# Altium project LLA1305.PrjPcb (part 1 of 2)
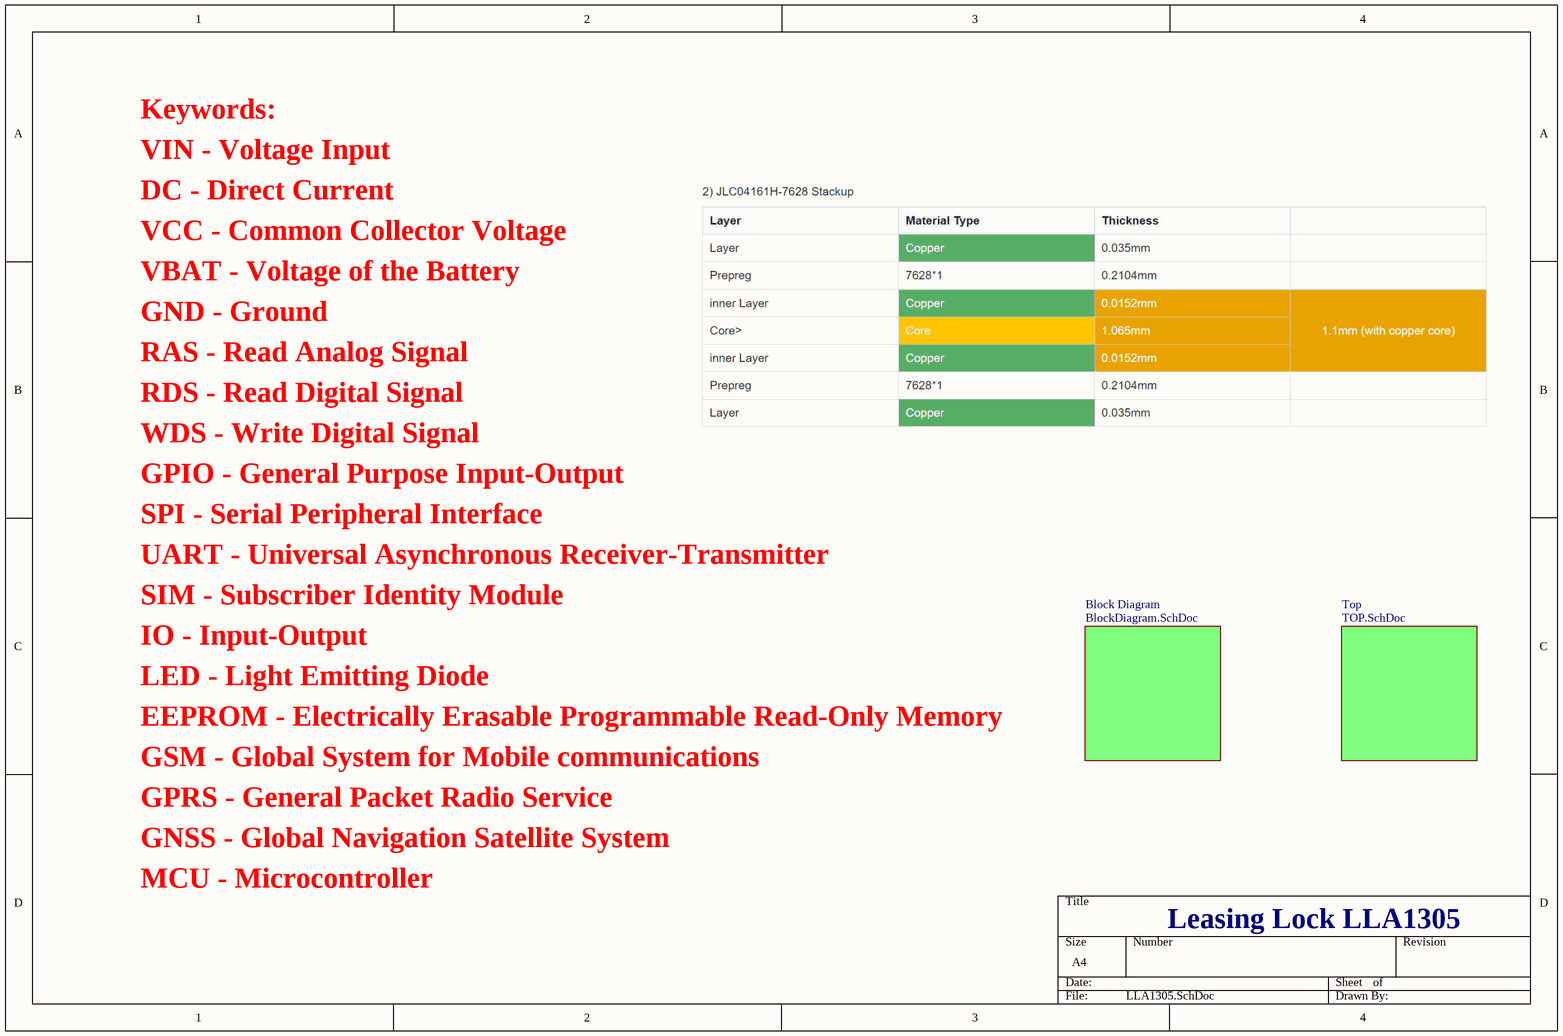
[diagram p0: LLA1305.SchDoc]
11 sheets, 164 parts. Net scope: flat (ports and power ports of the same name join across sheets).
Board file: LLA1305.PcbDoc
Sheets:
  LLA1305.SchDoc
    Block Diagram = BlockDiagram.SchDoc
    Top = TOP.SchDoc
      GSM/GPRS/GNSS Module = MC60.SchDoc
      Microcontroller = MCU.SchDoc
      EEPROM Memory = EEPROM.SchDoc
      SIM Card Slot = SIM.SchDoc
      Power Management = Power.SchDoc
      RS-485 Transceiver = RS485.SchDoc
      IO PORTs = IOs.SchDoc
      Interface LEDs = LEDs.SchDoc

## Sheet LLA1305.SchDoc
size A4; SheetNumber: 1; SheetTotal: 11

### Sub-sheets
Block Diagram = BlockDiagram.SchDoc: no entries
Top = TOP.SchDoc: no entries

### Notes on the sheet
- Keywords:
- VIN - Voltage Input
- DC - Direct Current
- VCC - Common Collector Voltage
- VBAT - Voltage of the Battery
- RAS - Read Analog Signal
- GND - Ground
- RDS - Read Digital Signal
- WDS - Write Digital Signal
- GPIO - General Purpose Input-Output
- SPI - Serial Peripheral Interface
- UART - Universal Asynchronous Receiver-Transmitter
- SIM - Subscriber Identity Module
- IO - Input-Output
- LED - Light Emitting Diode
- EEPROM - Electrically Erasable Programmable Read-Only Memory
- GSM - Global System for Mobile communications
- GPRS - General Packet Radio Service
- GNSS - Global Navigation Satellite System
- MCU - Microcontroller
- Leasing Lock LLA1305

## Sheet BlockDiagram.SchDoc
size A3; SheetNumber: 2; SheetTotal: 11
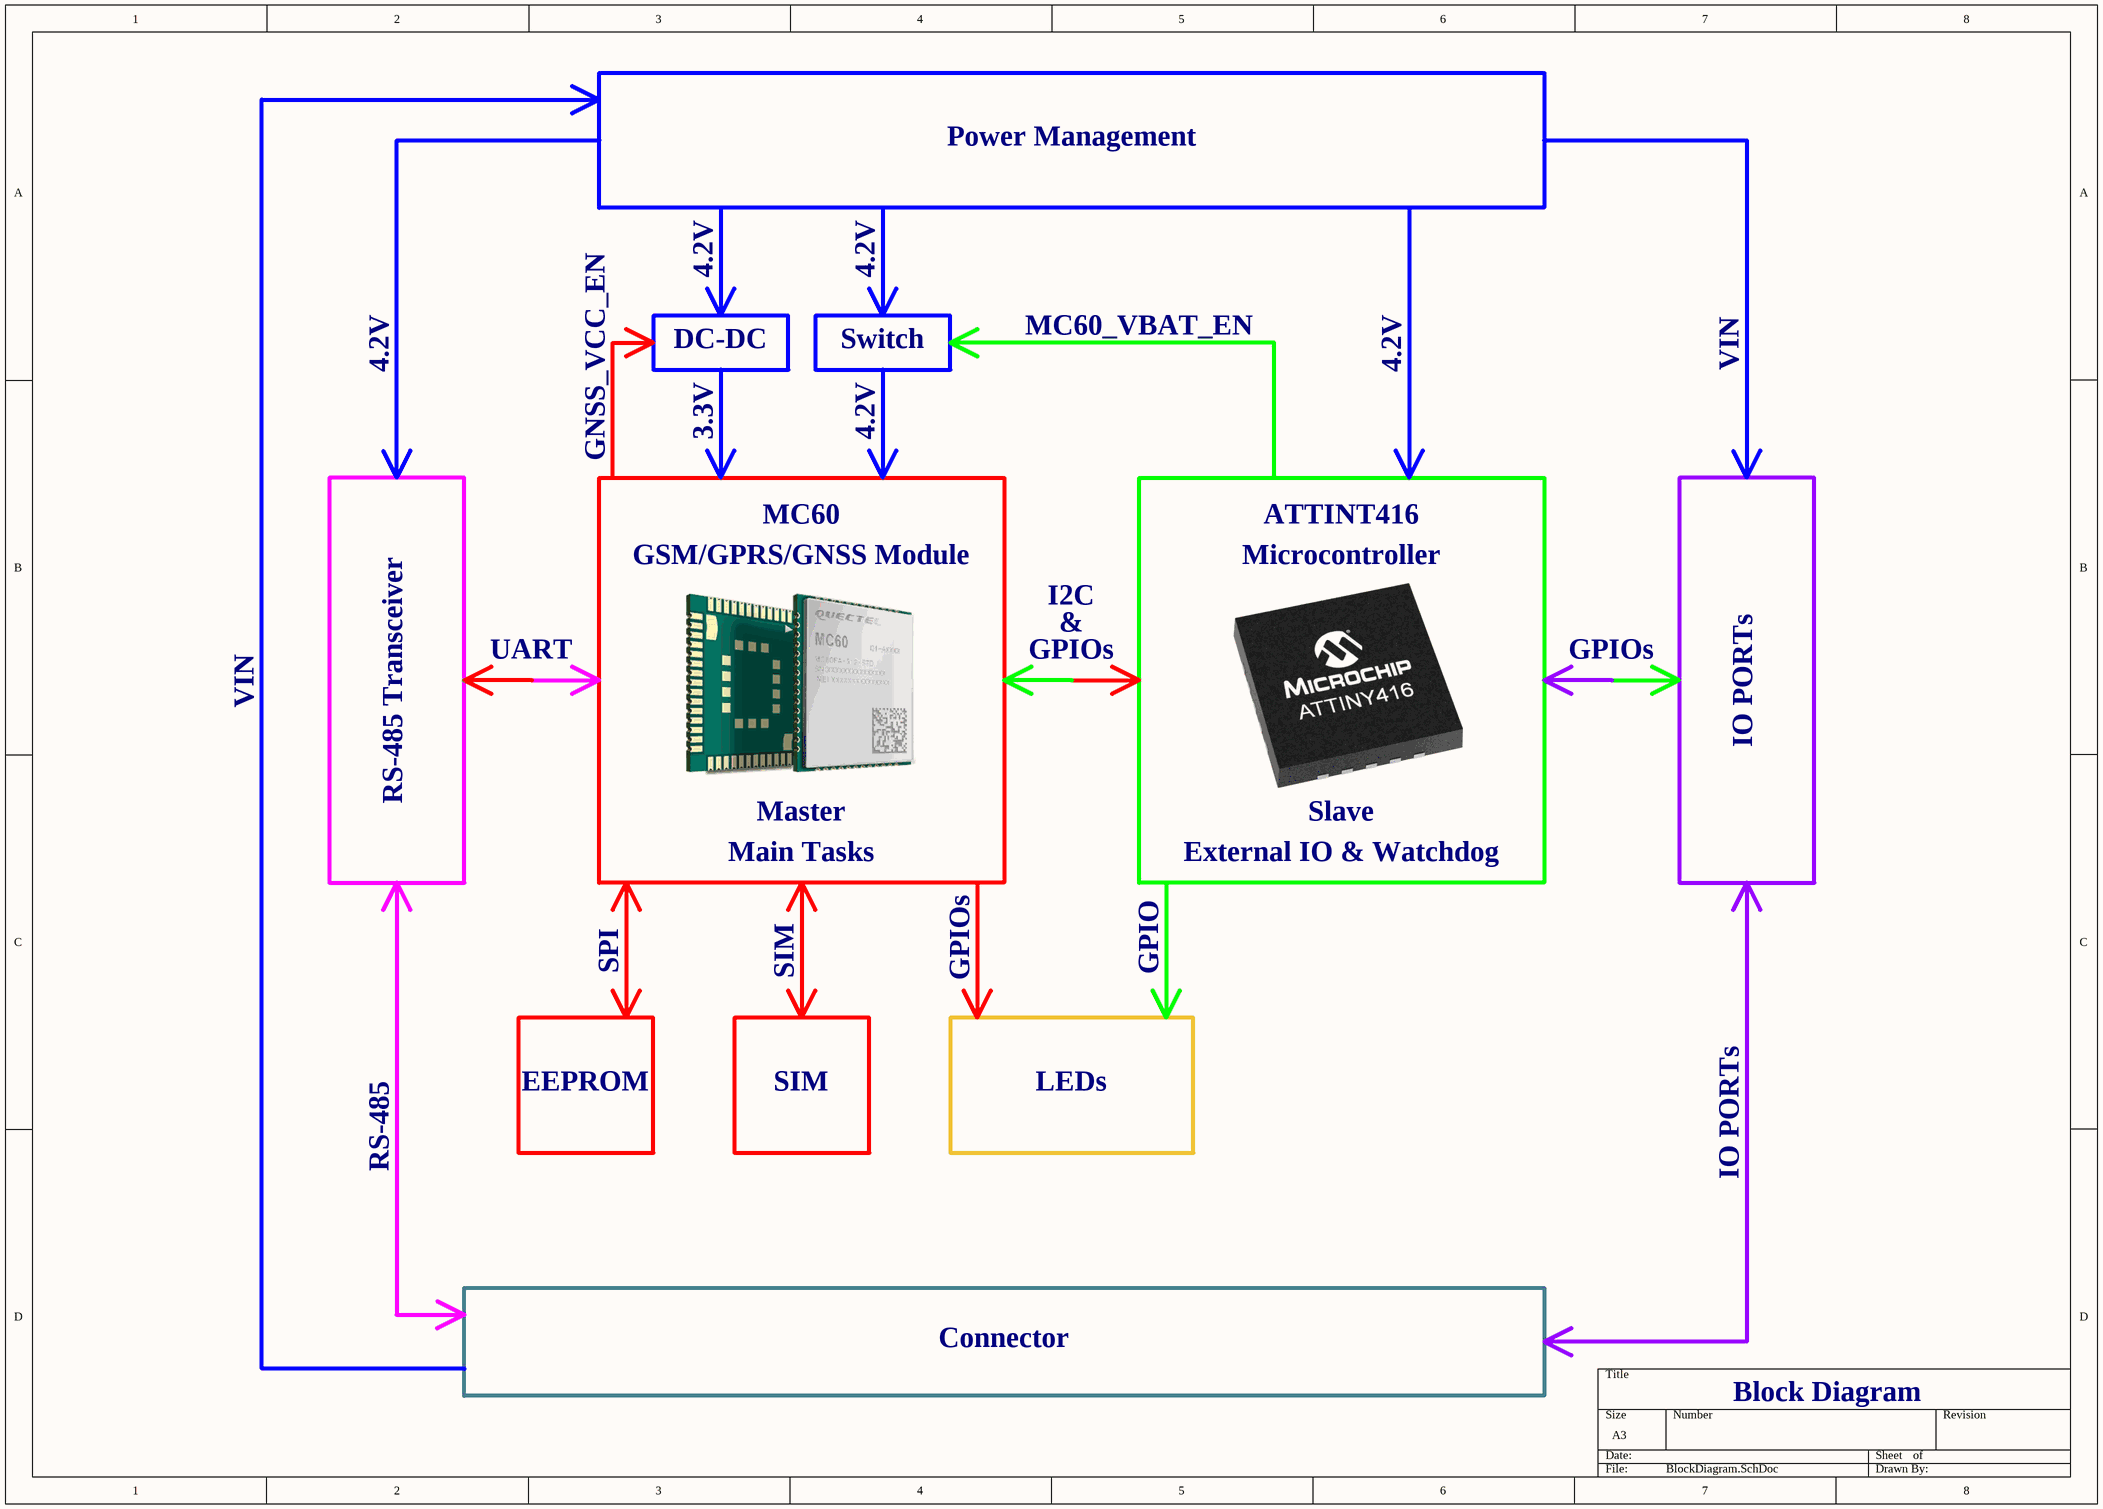
[diagram p1: BlockDiagram.SchDoc]

### Notes on the sheet
- Power Management
- 4.2V
- GNSS_VCC_EN
- DC-DC
- Switch
- MC60_VBAT_EN
- VIN
- 3.3V
- MC60
- GSM/GPRS/GNSS Module
- ATTINT416
- Microcontroller
- &
- I2C
- RS-485 Transceiver
- UART
- GPIOs
- IO PORTs
- Master
- Slave
- Main Tasks
- External IO & Watchdog
- SPI
- SIM
- GPIO
- RS-485
- EEPROM
- LEDs
- Connector
- Block Diagram

## Sheet TOP.SchDoc
size A3; SheetNumber: 3; SheetTotal: 11
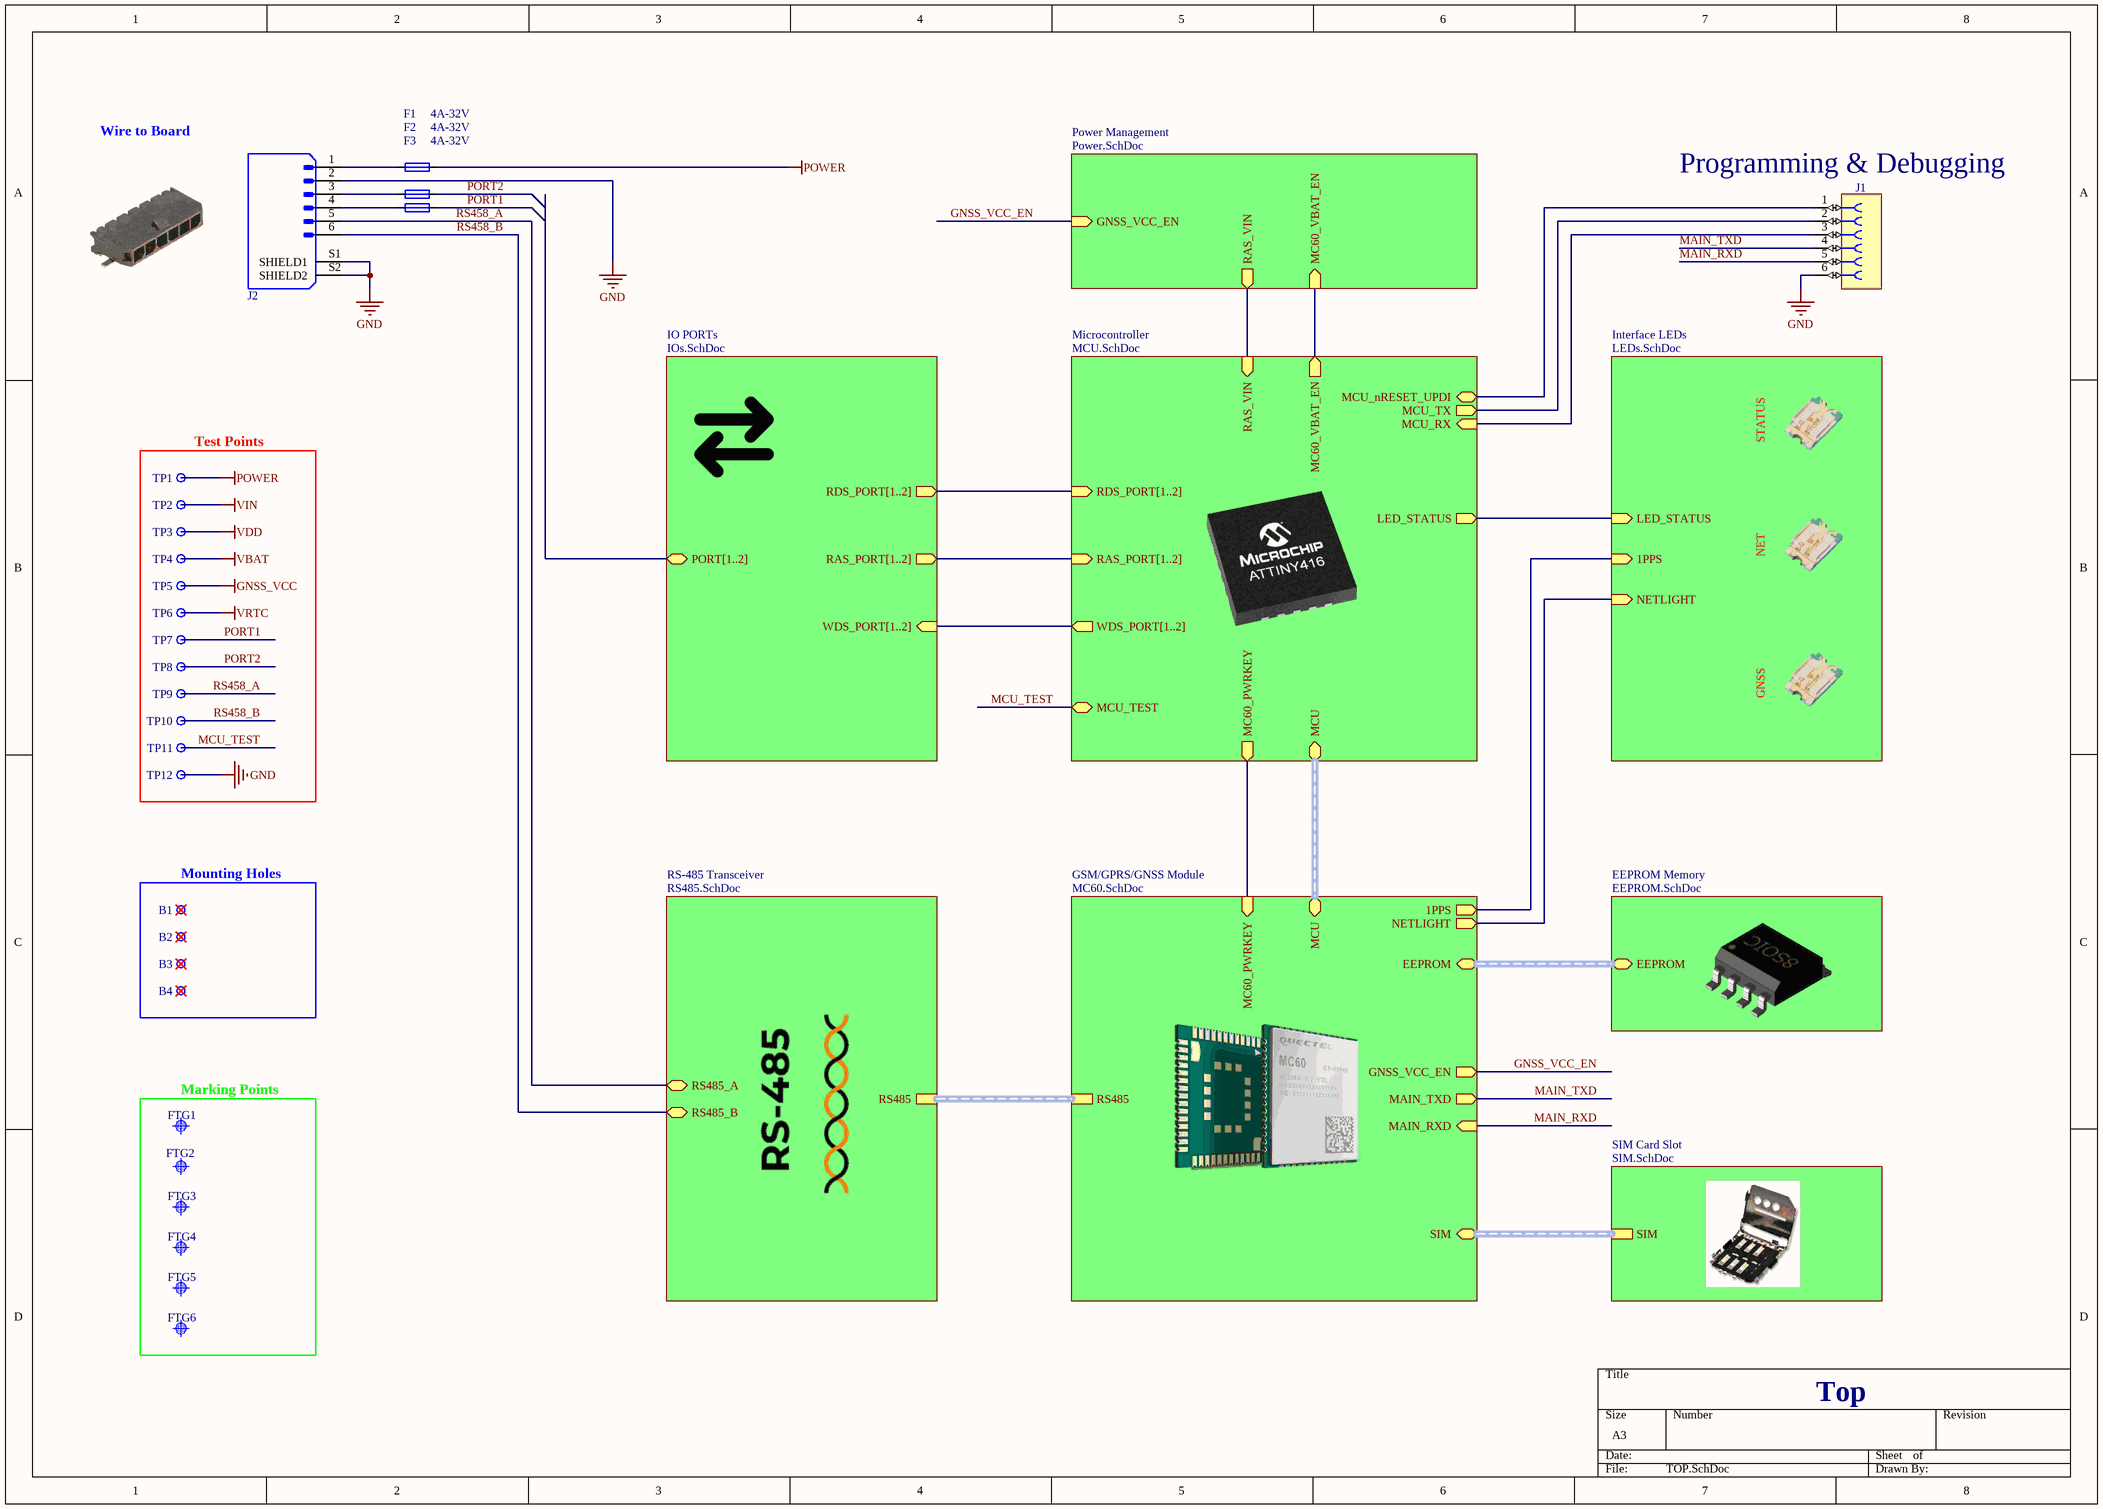
[diagram p2: TOP.SchDoc]

### Parts
B1  Non Plated Hole  [MTG520]  (value not drawn)  (no BOM)
B2  Non Plated Hole  [MTG520]  (value not drawn)  (no BOM)
B3  Non Plated Hole  [MTG520]  (value not drawn)  (no BOM)
B4  Non Plated Hole  [MTG520]  (value not drawn)  (no BOM)
F1  4A-32V  [FUSC_LITTELFUSE_466]
F2  4A-32V  [FUSC_LITTELFUSE_466]
F3  4A-32V  [FUSC_LITTELFUSE_466]
FTG1  Use only in PCB  [FIDUCIAL_TOP_C100-200]  (value not drawn)
FTG2  Use only in PCB  [FIDUCIAL_TOP_C100-200]  (value not drawn)
FTG3  Use only in PCB  [FIDUCIAL_TOP_C100-200]  (value not drawn)
FTG4  Use only in PCB  [FIDUCIAL_TOP_C100-200]  (value not drawn)
FTG5  Use only in PCB  [FIDUCIAL_TOP_C100-200]  (value not drawn)
FTG6  Use only in PCB  [FIDUCIAL_TOP_C100-200]  (value not drawn)
J1  Socket 6  [SAMTEC_SSW-106-01-L-S]  (value not drawn)
J2  43650-0613  [MOLEX_43650-0613]  (value not drawn)
TP1  Test Point  [TPS127]  (value not drawn)
TP2  Test Point  [TPS127]  (value not drawn)
TP3  Test Point  [TPS127]  (value not drawn)
TP4  Test Point  [TPS127]  (value not drawn)
TP5  Test Point  [TPS127]  (value not drawn)
TP6  Test Point  [TPS127]  (value not drawn)
TP7  Test Point  [TPS127]  (value not drawn)
TP8  Test Point  [TPS127]  (value not drawn)
TP9  Test Point  [TPS127]  (value not drawn)
TP10  Test Point  [TPS127]  (value not drawn)
TP11  Test Point  [TPS127]  (value not drawn)
TP12  Test Point  [TPS127]  (value not drawn)

### Blocks framed on the sheet
Test Points: TP1-TP12
Mounting Holes: B1-B4
Marking Points: FTG1-FTG6

### Sub-sheets
EEPROM Memory = EEPROM.SchDoc: EEPROM (bidir, harness EEPROM)
GSM/GPRS/GNSS Module = MC60.SchDoc: SIM (bidir, harness SIM), EEPROM (bidir, harness EEPROM), RS485 (harness RS485), MCU (bidir, harness MCU), MC60_PWRKEY (in), NETLIGHT (out), GNSS_VCC_EN (out), 1PPS (out), MAIN_TXD (out), MAIN_RXD (in)
Interface LEDs = LEDs.SchDoc: LED_STATUS (in), 1PPS (in), NETLIGHT (in)
IO PORTs = IOs.SchDoc: WDS_PORT[1..2] (in), RAS_PORT[1..2] (out), RDS_PORT[1..2] (out), PORT[1..2] (bidir)
Microcontroller = MCU.SchDoc: MCU (bidir, harness MCU), MC60_PWRKEY (out), LED_STATUS (out), RDS_PORT[1..2] (in), RAS_PORT[1..2] (in), WDS_PORT[1..2] (out), MC60_VBAT_EN (out), RAS_VIN (in), MCU_nRESET_UPDI (bidir), MCU_TEST (bidir), MCU_TX (out), MCU_RX (in)
Power Management = Power.SchDoc: GNSS_VCC_EN (in), MC60_VBAT_EN (in), RAS_VIN (out)
RS-485 Transceiver = RS485.SchDoc: RS485_A (bidir), RS485_B (bidir), RS485 (harness RS485)
SIM Card Slot = SIM.SchDoc: SIM (harness SIM)

### Nets
GND: J1.6 J2.2 J2.S1(SHIELD1) J2.S2(SHIELD2) TP12.1
GNSS_VCC: TP5.1
POWER: F1.2 TP1.1
VBAT: TP4.1
VDD: TP3.1
VIN: TP2.1
VRTC: TP6.1
GNSS_VCC_EN: sheet GSM/GPRS/GNSS Module/GNSS_VCC_EN, sheet Power Management/GNSS_VCC_EN
MAIN_RXD: J1.5 ; sheet GSM/GPRS/GNSS Module/MAIN_RXD
MAIN_TXD: J1.4 ; sheet GSM/GPRS/GNSS Module/MAIN_TXD
MCU_TEST: TP11.1 ; sheet Microcontroller/MCU_TEST
PORT1: F3.2 TP7.1
PORT2: F2.2 TP8.1
RS458_A: J2.5 TP9.1 ; sheet RS-485 Transceiver/RS485_A
RS458_B: J2.6 TP10.1 ; sheet RS-485 Transceiver/RS485_B
NetF1_1: F1.1 J2.1
NetF2_1: F2.1 J2.3
NetF3_1: F3.1 J2.4
NetJ1_1: J1.1 ; sheet Microcontroller/MCU_nRESET_UPDI
NetJ1_2: J1.2 ; sheet Microcontroller/MCU_TX
NetJ1_3: J1.3 ; sheet Microcontroller/MCU_RX
(unnamed): sheet GSM/GPRS/GNSS Module/MC60_PWRKEY, sheet Microcontroller/MC60_PWRKEY
(unnamed): sheet GSM/GPRS/GNSS Module/NETLIGHT, sheet Interface LEDs/NETLIGHT
(unnamed): sheet GSM/GPRS/GNSS Module/1PPS, sheet Interface LEDs/1PPS
(unnamed): sheet Microcontroller/LED_STATUS, sheet Interface LEDs/LED_STATUS
(unnamed): sheet Microcontroller/MC60_VBAT_EN, sheet Power Management/MC60_VBAT_EN
(unnamed): sheet Microcontroller/RAS_VIN, sheet Power Management/RAS_VIN

Not connected (* = marked no-connect by the designer): B1 1*; B2 1*; B3 1*; B4 1*

### Buses and harness runs
bus sheet IO PORTs/RAS_PORT[1..2] = sheet Microcontroller/RAS_PORT[1..2]
bus sheet IO PORTs/RDS_PORT[1..2] = sheet Microcontroller/RDS_PORT[1..2]
bus sheet IO PORTs/WDS_PORT[1..2] = sheet Microcontroller/WDS_PORT[1..2]
harness sheet EEPROM Memory/EEPROM = sheet GSM/GPRS/GNSS Module/EEPROM
harness sheet GSM/GPRS/GNSS Module/MCU = sheet Microcontroller/MCU
harness sheet GSM/GPRS/GNSS Module/RS485 = sheet RS-485 Transceiver/RS485
harness sheet GSM/GPRS/GNSS Module/SIM = sheet SIM Card Slot/SIM

### Notes on the sheet
- Wire to Board
- (near J1) Programming & Debugging
- STATUS
- NET
- GNSS
- Top

### Library data of the parts
B1-B4 = NON-PLATED_HOLE5.2: Single Terminal Socket; Part Description: Non Plated Through Hole: Hole Dia.=5.2mm; Mounted: No; Part Number: NON-PLATED_HOLE5.2; Component Type: Standard (No BOM); Pin Count: 1; Family: Non Plated Hole; Socket: No; SMD: No; Sense: No; Status: None; ComponentHeight: 0mm; HelpURL: Undefined; Author: CERN DEM JMW; CreateDate: 27.09.2011; LatestRevisionDate: 27.09.2011; PackageDescription: Non Plated Through Hole: Hole Dia.=5.2mm
F1-F3 = FUS1206_LITTELFUSE_0466004.NR: Fuse; Part Description: Very Fast-Acting Surface Mount Thin Film Fuse, Size 1206, Series 466; PressFit: No; Part Number: FUS1206_LITTELFUSE_0466004.NR; Component Kind: Standard; Component Type: Standard; Pin Count: 2; Case: 1206; PackageDescription: Very Fast-Acting Surface Mount Thin Film Fuse, Size 1206, 466 Series; Family: Fuse; Mounted: Yes; Socket: No; SMD: Yes; Sense: No; Value: 4A-32V; Manufacturer: LITTELFUSE; Manufacturer Part Number: 0466004.NR; ComponentHeight: 0.66mm; HelpURL: \\cern.ch\dfs\Applications\Altium\Datasheets\FUSE_LITTELFUSE_466.pdf; Author: CERN DEM BC; CreateDate: 23.04.2020; LatestRevisionDate: 23.04.2020
FTG1-FTG6 = FIDUCIAL_TARGET_C100-200: Fiducial Target; Part Description: Round Fiducial Target, Top Layer, 1.0mm, Top Solder 2.0mm, Keepout =2.0mm; Mounted: No; Part Number: FIDUCIAL_TARGET_C100-200; Component Kind: Standard (No BOM); Component Type: Standard (No BOM); Pin Count: 1; Family: Fiducial; Socket: No; SMD: Yes; Sense: No; Status: None; ComponentHeight: 0mm; HelpURL: Undefined; Author: CERN DEM JLC; CreateDate: 09.02.2010; LatestRevisionDate: 04.04.2012; PackageDescription: Round Fiducial Target, Top Layer, 1.0mm, Top Solder 2.0mm, Keepout =2.0mm
J1 = SAMTEC_SSW-106-01-L-S: Connector 6 Female; Part Description: 6 Contacts, Pitch 2.54mm, Single Row Through Mount Straight Socket (Lead Length 2.64mm); Manufacturer: OPEN; PressFit: No; Part Number: SAMTEC_SSW-106-01-L-S; Component Kind: Standard; Component Type: Standard; Pin Count: 6; Family: Socket 6; Mounted: Yes; Socket: No; SMD: No; Sense: No; Status: None; Manufacturer Part Number: OPEN; ComponentHeight: 8.51mm; HelpURL: \\cern.ch\dfs\Applications\Altium\Datasheets\SAMTEC_SSW-106-01-L-S.pdf; Author: CERN DEM BC; CreateDate: 29.09.2021; LatestRevisionDate: 29.09.2021
J2 = MOLEX_43650-0613: Connector Header Surface Mount, Right Angle 6 position 0.118" (3.00mm); Manufacturer: MOLEX; MP: 436500613; PressFit: No; Availability: Unavailable; Price: None; Package: None; Value: *; Part Number: MOLEX_43650-0613; Component Kind: Standard; Component Type: Standard; Pin Count: 6; Family: Micro-Fit 3.0 43650; Mounted: Yes; Socket: No; SMD: Yes; Sense: No; Status: None; Part Description: Connector Header Surface Mount, Right Angle 6 position 0.118" (3.00mm); Manufacturer Part Number: 43650-0613; ComponentHeight: 1.2mm; HelpURL: https://tools.molex.com/pdm_docs/sd/436500613_sd.pdf; Author: Xusniyor; CreateDate: 30.04.2023; LatestRevisionDate: 30.04.2023
TP1-TP12 = SMD_PAD_1.27X1.27MM: Part Description: 1.27mm x 1.27mm PCB Copper Area (SMD Test Point); Mounted: No; Part Number: SMD_PAD_1.27X1.27MM; Component Kind: Standard (No BOM); Component Type: Standard (No BOM); Pin Count: 1; Family: Test Point; Socket: No; SMD: No; Sense: No; Status: None; ComponentHeight: 0mm; HelpURL: Undefined; Author: CERN DEM JLC; CreateDate: 12.01.2008; LatestRevisionDate: 12.01.2008; PackageDescription: 1.27mm x 1.27mm PCB Copper Area (SMD Test Point)

## Sheet MC60.SchDoc
size A3; SheetNumber: 6; SheetTotal: 11
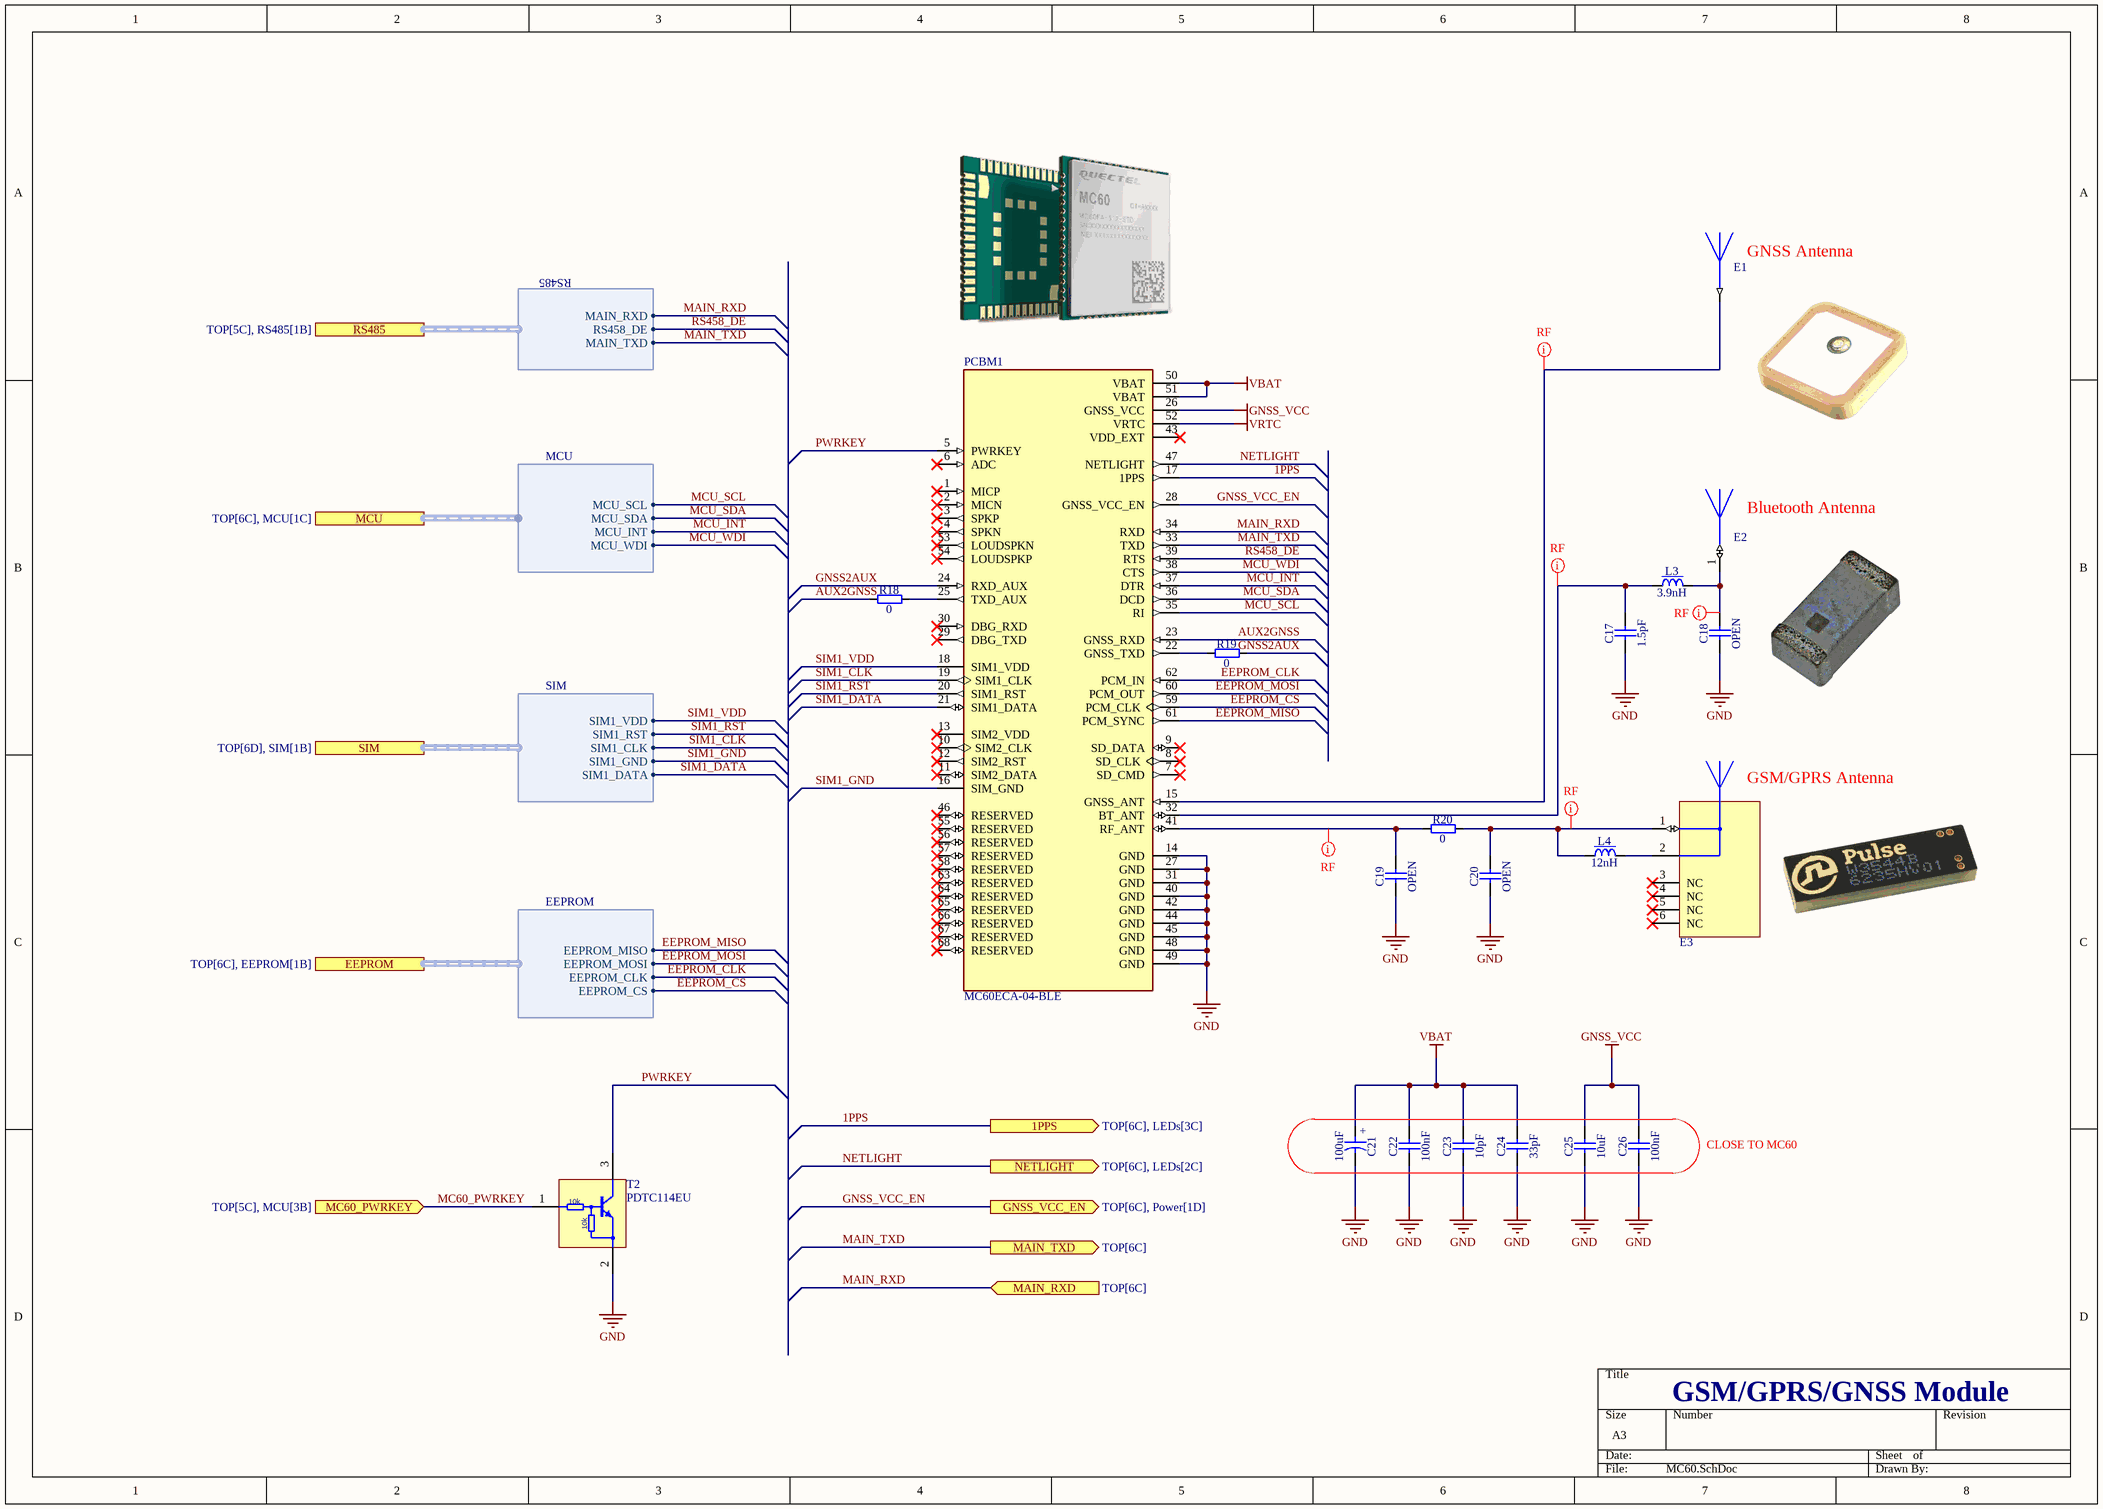
[diagram p3: MC60.SchDoc]

### Parts
C17  1.5pF  [CAPC1005X55N]
C18  OPEN  [CAPC1005X55N]
C19  OPEN  [CAPC1005X55N]
C20  OPEN  [CAPC1005X55N]
C21  100uF  [CAPMP7343X310N]
C22  100nF  [CAPC1608X87N]
C23  10pF  [CAPC1608X87N]
C24  33pF  [CAPC1608X87N]
C25  10uF  [CAPC2012X135N]
C26  100nF  [CAPC1608X87N]
E1  APAE1590R2540AKDB1-T  [GPS_GLONASS_CERAMIC_25X25]  (value not drawn)
E2  AMCA31-2R450G-S1F-T3  [AMCA31-2R450G-S1F-T3]  (value not drawn)
E3  W3544B  [PULSE_ELECTRONICS_W3544X]  (value not drawn)
L3  3.9nH  [IND_MURATA_LQW18AS_0Z]
L4  12nH  [IND_MURATA_LQW18AS_0Z]
PCBM1  MC60ECA-04-BLE  [PCBM_QUECTEL_MC60]
R18  0  [RESC1608X55N]
R19  0  [RESC1608X55N]
R20  0  [RESC1005X40N]
T2  PDTC114EU  [SOT65P210X100-3N]

### Ports
1PPS (out, see TOP[6C], LEDs[3C]), EEPROM (harness EEPROM, see TOP[6C], EEPROM[1B]), GNSS_VCC_EN (out, see TOP[6C], Power[1D]), MAIN_RXD (in, see TOP[6C]), MAIN_TXD (out, see TOP[6C]), MC60_PWRKEY (in, see TOP[5C], MCU[3B]), MCU (harness MCU, see TOP[6C], MCU[1C]), NETLIGHT (out, see TOP[6C], LEDs[2C]), RS485 (harness RS485, see TOP[5C], RS485[1B]), SIM (harness SIM, see TOP[6D], SIM[1B])

### Harnesses
EEPROM: EEPROM_MISO, EEPROM_MOSI, EEPROM_CLK, EEPROM_CS
SIM: SIM1_VDD, SIM1_RST, SIM1_CLK, SIM1_GND, SIM1_DATA
RS485: MAIN_RXD, RS458_DE, MAIN_TXD
MCU: MCU_SCL, MCU_SDA, MCU_INT, MCU_WDI

### Nets
GND: C17.1 C18.1 C19.1 C20.1 C21.2 C22.1 C23.1 C24.1 C25.1 C26.1 PCBM1.14(GND) PCBM1.27(GND) PCBM1.31(GND) PCBM1.40(GND) PCBM1.42(GND) PCBM1.44(GND) PCBM1.45(GND) PCBM1.48(GND) PCBM1.49(GND) T2.2(E)
GNSS_VCC: C25.2 C26.2 PCBM1.26(GNSS_VCC)
VBAT: C21.1 C22.2 C23.2 C24.2 PCBM1.50(VBAT) PCBM1.51(VBAT)
VRTC: PCBM1.52(VRTC)
1PPS: PCBM1.17(1PPS) ; port 1PPS
AUX2GNSS: PCBM1.23(GNSS_RXD) R18.1
EEPROM_CLK: PCBM1.62(PCM_IN) ; port EEPROM.EEPROM_CLK
EEPROM_CS: PCBM1.59(PCM_CLK) ; port EEPROM.EEPROM_CS
EEPROM_MISO: PCBM1.61(PCM_SYNC) ; port EEPROM.EEPROM_MISO
EEPROM_MOSI: PCBM1.60(PCM_OUT) ; port EEPROM.EEPROM_MOSI
GNSS2AUX: PCBM1.24(RXD_AUX) R19.2
GNSS_VCC_EN: PCBM1.28(GNSS_VCC_EN) ; port GNSS_VCC_EN
MAIN_RXD: PCBM1.34(RXD) ; port MAIN_RXD, port RS485.MAIN_RXD
MAIN_TXD: PCBM1.33(TXD) ; port MAIN_TXD, port RS485.MAIN_TXD
MC60_PWRKEY: T2.1(B) ; port MC60_PWRKEY
MCU_INT: PCBM1.37(DTR) ; port MCU.MCU_INT
MCU_SCL: PCBM1.35(RI) ; port MCU.MCU_SCL
MCU_SDA: PCBM1.36(DCD) ; port MCU.MCU_SDA
MCU_WDI: PCBM1.38(CTS) ; port MCU.MCU_WDI
NETLIGHT: PCBM1.47(NETLIGHT) ; port NETLIGHT
PWRKEY: PCBM1.5(PWRKEY) T2.3(C)
RS458_DE: PCBM1.39(RTS) ; port RS485.RS458_DE
SIM1_CLK: PCBM1.19(SIM1_CLK) ; port SIM.SIM1_CLK
SIM1_DATA: PCBM1.21(SIM1_DATA) ; port SIM.SIM1_DATA
SIM1_GND: PCBM1.16(SIM_GND) ; port SIM.SIM1_GND
SIM1_RST: PCBM1.20(SIM1_RST) ; port SIM.SIM1_RST
SIM1_VDD: PCBM1.18(SIM1_VDD) ; port SIM.SIM1_VDD
NetC17_2: C17.2 L3.1 PCBM1.32(BT_ANT)
NetC18_2: C18.2 E2.1 L3.2
NetC19_2: C19.2 PCBM1.41(RF_ANT) R20.1
NetC20_2: C20.2 E3.1 L4.1 R20.2
NetE1_1: E1.1 PCBM1.15(GNSS_ANT)
NetE3_2: E3.2 L4.2
NetPCBM1_22: PCBM1.22(GNSS_TXD) R19.1
NetPCBM1_25: PCBM1.25(TXD_AUX) R18.2

Not connected (* = marked no-connect by the designer): E3 3(NC)* 4(NC)* 5(NC)* 6(NC)*; PCBM1 1(MICP)* 2(MICN)* 3(SPKP)* 4(SPKN)* 6(ADC)* 7(SD_CMD)* 8(SD_CLK)* 9(SD_DATA)* 10(SIM2_CLK)* 11(SIM2_DATA)* 12(SIM2_RST)* 13(SIM2_VDD)* 29(DBG_TXD)* 30(DBG_RXD)* 43(VDD_EXT)* 46(RESERVED)* 53(LOUDSPKN)* 54(LOUDSPKP)* 55(RESERVED)* 56(RESERVED)* 57(RESERVED)* 58(RESERVED)* 63(RESERVED)* 64(RESERVED)* 65(RESERVED)* 66(RESERVED)* 67(RESERVED)* 68(RESERVED)*

### Layout directives
net class RF: NetC17_2, NetC18_2, NetC19_2, NetC20_2, NetE1_1

### Notes on the sheet
- (near E1) GNSS Antenna
- (near E2) Bluetooth Antenna
- GSM/GPRS Antenna
- CLOSE TO MC60
- GSM/GPRS/GNSS Module
- (in symbol CTE7343-31_100UF_10V_10%_LESR0050) +
- (in symbol PDTC114EU) 10k

### Library data of the parts
C17 = CC0402_1.5PF_50V_0.25PF_C0G: Non-polarised capacitor; Part Description: SMD Multilayer Chip Ceramic Capacitor; Manufacturer: GENERIC; Manufacturer1 Part Number: C0402C159C5GACTU; Voltage: 50V; TC: C0G/NP0; Tolerance: ±0.25pF; Part Number: CC0402_1.5PF_50V_0.25PF_C0G; Component Kind: Standard; Component Type: Standard; Pin Count: 2; Value: 1.5pF; Status: Preferred; Manufacturer Part Number: CC0402_1.5PF_50V_0.25PF_C0G; Case: 0402; Mounted: Yes; Socket: No; SMD: Yes; Sense: No; Manufacturer1 Example: KEMET; Manufacturer1 ComponentHeight: 0.55mm; HelpURL: \\cern.ch\dfs\Applications\Altium\Datasheets\CC0402_C0G_KEMET_(Commercial Grade).pdf; Author: CERN DEM JLC; CreateDate: 03.12.2007; LatestRevisionDate: 22.04.2015
C18-C20 = CC0402_0.2PF_50V_0.05PF_C0G_KEMET_HiQ-CBR: Non-polarised capacitor; Part Description: High Q and low ESR, SMD Multilayer Chip Ceramic Capacitor, HiQ-CBR Series; Value: 0.2pF; Voltage: 50V; TC: C0G/NP0; Tolerance: ±0.05pF; Part Number: CC0402_0.2PF_50V_0.05PF_C0G_KEMET_HiQ-CBR; Component Kind: Standard; Component Type: Standard; Pin Count: 2; Status: Not Recommended; Manufacturer: OPEN; Manufacturer Part Number: OPEN; Case: 0402; Mounted: Yes; Socket: No; SMD: Yes; Sense: No; ComponentHeight: 0.55mm; HelpURL: \\cern.ch\dfs\Applications\Altium\Datasheets\CC0402_C0G_KEMET_HiQ-CBR.pdf; Author: CERN DEM JLC; CreateDate: 09.03.2017; LatestRevisionDate: 21.11.2017
C21 = CTE7343-31_100UF_10V_10%_LESR0050: Polarised capacitor; Part Description: Low ESR 0R050 Solid Tantalum Chip Capacitor; Manufacturer: GENERIC; Manufacturer1 Part Number: TPSD107K010R0050; Voltage: 10V; Tolerance: ±10%; Part Number: CTE7343-31_100UF_10V_10%_LESR0050; Component Kind: Standard; Component Type: Standard; Pin Count: 2; Value: 100uF; Status: Preferred; Manufacturer Part Number: CTE7343-31_100UF_10V_10%_LESR0050; Case: D; Mounted: Yes; Socket: No; SMD: Yes; Sense: No; Manufacturer1 Example: AVX; Manufacturer1 ComponentHeight: 3.1mm; HelpURL: \\cern.ch\dfs\Applications\Altium\Datasheets\CTE-LESR_AVX_TPS.pdf; Author: CERN DEM JLC; CreateDate: 05.05.2008; LatestRevisionDate: 20.01.2009
C22 C26 = CC0603_100NF_50V_10%_X7R: Non-polarised capacitor; Part Description: SMD Multilayer Chip Ceramic Capacitor; Manufacturer: GENERIC; Manufacturer1 Part Number: 223858615649; Voltage: 50V; TC: X7R; Tolerance: ±10%; Part Number: CC0603_100NF_50V_10%_X7R; Component Kind: Standard; Component Type: Standard; Pin Count: 2; Value: 100nF; Status: Preferred; Manufacturer Part Number: CC0603_100NF_50V_10%_X7R; Case: 0603; Mounted: Yes; Socket: No; SMD: Yes; Sense: No; Manufacturer1 Example: PHYCOMP; Manufacturer1 ComponentHeight: 0.87mm; HelpURL: \\cern.ch\dfs\Applications\Altium\Datasheets\CC0603_X7R_PHYCOMP.pdf; Author: CERN DEM JLC; CreateDate: 03.12.2007; LatestRevisionDate: 03.12.2007
C23 = CC0603_10PF_50V_5%_NP0: Non-polarised capacitor; Part Description: SMD Multilayer Chip Ceramic Capacitor; Manufacturer: GENERIC; Manufacturer1 Part Number: 223886715109; Voltage: 50V; TC: C0G/NP0; Tolerance: ±5%; Part Number: CC0603_10PF_50V_5%_NP0; Component Kind: Standard; Component Type: Standard; Pin Count: 2; Value: 10pF; Status: Preferred; Manufacturer Part Number: CC0603_10PF_50V_5%_NP0; Case: 0603; Mounted: Yes; Socket: No; SMD: Yes; Sense: No; Manufacturer1 Example: PHYCOMP; Manufacturer1 ComponentHeight: 0.87mm; HelpURL: \\cern.ch\dfs\Applications\Altium\Datasheets\CC0603_NP0_PHYCOMP.pdf; Author: CERN DEM JLC; CreateDate: 03.12.2007; LatestRevisionDate: 03.12.2007
C24 = CC0603_33PF_50V_5%_NP0: Non-polarised capacitor; Part Description: SMD Multilayer Chip Ceramic Capacitor; Manufacturer: GENERIC; Manufacturer1 Part Number: 223886715339; Voltage: 50V; TC: C0G/NP0; Tolerance: ±5%; Part Number: CC0603_33PF_50V_5%_NP0; Component Kind: Standard; Component Type: Standard; Pin Count: 2; Value: 33pF; Status: Preferred; Manufacturer Part Number: CC0603_33PF_50V_5%_NP0; Case: 0603; Mounted: Yes; Socket: No; SMD: Yes; Sense: No; Manufacturer1 Example: PHYCOMP; Manufacturer1 ComponentHeight: 0.87mm; HelpURL: \\cern.ch\dfs\Applications\Altium\Datasheets\CC0603_NP0_PHYCOMP.pdf; Author: CERN DEM JLC; CreateDate: 03.12.2007; LatestRevisionDate: 03.12.2007
C25 = CC0805_10UF_10V_10%_X7R: Non-polarised capacitor; Part Description: SMD Multilayer Chip Ceramic Capacitor; Manufacturer: GENERIC; Manufacturer1 Part Number: GRM21BR71A106KE51L; Voltage: 10V; TC: X7R; Tolerance: ±10%; Part Number: CC0805_10UF_10V_10%_X7R; Component Kind: Standard; Component Type: Standard; Pin Count: 2; Value: 10uF; Status: Preferred; Manufacturer Part Number: CC0805_10UF_10V_10%_X7R; Case: 0805; Mounted: Yes; Socket: No; SMD: Yes; Sense: No; Manufacturer1 Example: MURATA; Manufacturer1 ComponentHeight: 1.35mm; HelpURL: \\cern.ch\dfs\Applications\Altium\Datasheets\CC0805_X7R_MURATA.pdf; Author: CERN DEM JLC; CreateDate: 30.04.2012; LatestRevisionDate: 30.04.2012
E1 = ABRACON_APAE1590R2540AKDB1-T: 1.575GHz, 1.602GHz GLONASS, GPS Ceramic Patch RF Antenna 1.575GHz ~ 1.608GHz Pin Adhesive; MF: Abracon LLC; Check_prices: https://www.snapeda.com/parts/APAE1590R2540AKDB1-T/Abracon+LLC/view-part/?ref=eda; Purchase-URL: https://pricing.snapeda.com/search/part/APAE1590R2540AKDB1-T/?ref=eda; Value: *; Availability: In Stock; Package: None; SnapEDA_Link: https://www.snapeda.com/parts/APAE1590R2540AKDB1-T/Abracon+LLC/view-part/?ref=snap; MP: APAE1590R2540AKDB1-T; Price: None; Part Number: ABRACON_APAE1590R2540AKDB1-T; Device: APAE1590R2540AKDB1-T; Footprint: GPS-GLONASS ANT 25.0mm x 25mm; Pin Count: 1; PackageDescription: GPS-GLONASS ANT 25.0mm x 25mm; Family: APAE; Mounted: Yes; Socket: No; SMD: No; Sense: No; Status: None; Part Description: 1.575GHz, 1.602GHz GLONASS, GPS Ceramic Patch RF Antenna 1.575GHz ~ 1.608GHz Pin Adhesive; Manufacturer: Abracon LLC; Manufacturer Part Number: APAE1590R2540AKDB1-T; HelpURL: https://abracon.com/patchantenna/APAE1590R2540AKDB1-T.pdf; Author: Xusniyor; CreateDate: 21.04.2023; LatestRevisionDate: 21.04.2023
E2 = AMCA31-2R450G-S1F-T3: 2.4GHz Bluetooth, Wi-Fi, WLAN Chip RF Antenna 2.405GHz ~ 2.495GHz 0.5dBi Solder Surface Mount; MF: Abracon LLC; Check_prices: https://www.snapeda.com/parts/AMCA31-2R450G-S1F-T3/Abracon+LLC/view-part/?ref=eda; Purchase-URL: https://pricing.snapeda.com/search/part/AMCA31-2R450G-S1F-T3/?ref=eda; Value: *; Availability: In Stock; Package: None; SnapEDA_Link: https://www.snapeda.com/parts/AMCA31-2R450G-S1F-T3/Abracon+LLC/view-part/?ref=snap; MP: AMCA31-2R450G-S1F-T3; Price: None; Part Number: AMCA31-2R450G-S1F-T3; Device: AMCA31-2R450G-S1F-T3; Footprint: RF ANT 2.4GHZ CHIP SOLDER SMD; Pin Count: 2; PackageDescription: RF ANT 2.4GHZ CHIP SOLDER SMD; Family: AMCA; Mounted: Yes; Socket: No; SMD: Yes; Sense: No; Status: None; Part Description: 2.4GHz Bluetooth, Wi-Fi, WLAN Chip RF Antenna 2.405GHz ~ 2.495GHz 0.5dBi Solder Surface Mount; Manufacturer: Abracon LLC; Manufacturer Part Number: AMCA31-2R450G-S1F-T3; HelpURL: https://abracon.com/chip-antenna/AMCA31-2R450G-S1F-T3.pdf; Author: Xusniyor; CreateDate: 22.04.2023; LatestRevisionDate: 22.04.2023
E3 = PULSE_ELECTRONICS_W3544X: 850MHz, 900MHz, 1.8GHz, 1.9GHz, 2.1GHz GSM Chip RF Antenna 824MHz ~ 960MHz, 1.71GHz ~ 2.17GHz -1.5dBi, -1.1dBi, -1.1dBi, -1.5dBi Solder Surface Mount; Manufacturer: Pulse Electronics; Part Number: PULSE_ELECTRONICS_W3544X; Device: W3544B; Footprint: RF ANT 850MHZ/900MHZ CHIP SLD 26.00mm x 7.65mm; Pin Count: 6; PackageDescription: RF ANT 850MHZ/900MHZ CHIP SLD 26.00mm x 7.65mm; Family: None; Mounted: Yes; Socket: No; SMD: Yes; Sense: No; Status: None; Part Description: 850MHz, 900MHz, 1.8GHz, 1.9GHz, 2.1GHz GSM Chip RF Antenna 824MHz ~ 960MHz, 1.71GHz ~ 2.17GHz -1.5dBi, -1.1dBi, -1.1dBi, -1.5dBi Solder Surface Mount; Manufacturer Part Number: W3544B; HelpURL: https://productfinder.pulseelectronics.com/api/open/part-attachments/datasheet/W3544B; Author: Xusniyor; CreateDate: 20.04.2023; LatestRevisionDate: 20.04.2023
L3 = IND0603_12NH_5%_MURATA_LQW18AN3N9D00D: Inductor With Core; Part Description: 3.9 nH Unshielded Wirewound Inductor 850 mA 59mOhm Max 0603 (1608 Metric); Manufacturer: MURATA; Power: 850mA; Resistance: 0.059R; Tolerance: ±5%; Part Number: IND0603_12NH_5%_MURATA_LQW18AN3N9D00D; Component Kind: Standard; Component Type: Standard; Pin Count: 2; Value: 3.9nH; Manufacturer Part Number: LQW18AN3N9D00D; Case: 0603; Mounted: Yes; Socket: No; SMD: Yes; Sense: No; ComponentHeight: 1mm; HelpURL: https://search.murata.co.jp/Ceramy/image/img/P02/JELF243A-0024.pdf; Author: Xusniyor; CreateDate: 22.04.2023; LatestRevisionDate: 22.04.2023
L4 = IND0603_12NH_5%_MURATA_LQW18AN12NJ00D: Inductor With Core; Part Description: 12 nH Unshielded Wirewound Inductor 600 mA 130mOhm Max 0603 (1608 Metric); Manufacturer: MURATA; Power: 600mA; Resistance: 0.130R; Tolerance: ±5%; Part Number: IND0603_12NH_5%_MURATA_LQW18AN12NJ00D; Component Kind: Standard; Component Type: Standard; Pin Count: 2; Value: 12nH; Manufacturer Part Number: LQW18AN12NJ00D; Case: 0603; Mounted: Yes; Socket: No; SMD: Yes; Sense: No; ComponentHeight: 1mm; HelpURL: https://search.murata.co.jp/Ceramy/image/img/P02/JELF243A-0024.pdf; Author: Xusniyor; CreateDate: 21.04.2023; LatestRevisionDate: 21.04.2023
PCBM1 = MC60ECA-04-BLE: MC60 is a quad-band full-featured GSM/GPRS module using LCC castellation package. With an extensive set of Internet protocols (TCP, UDP, PPP, FTP, HTTP and SSL), it has integrated the GNSS technology for satellite navigation; Part Description: Cellular, Navigation BeiDou, Galileo, GLONASS, GPS, GNSS, GSM, GPRS Transceiver Module 850MHz, 900MHz, 1.561GHz, 1.575GHz, 1.602GHz, 1.8GHz, 1.9GHz Antenna Not Included Surface Mount; MF: Quectel; PressFit: No; Bonding: No; Purchase-URL: https://pricing.snapeda.com/search/part/MC60ECA-04-BLE/?ref=eda; Check_prices: https://www.snapeda.com/parts/MC60ECA-04-BLE/Quectel/view-part/?ref=eda; Availability: In Stock; Value: *; MP: MC60ECA-04-BLE; Price: None; Package: Custom Quectel; SnapEDA_Link: https://www.snapeda.com/parts/MC60ECA-04-BLE/Quectel/view-part/?ref=snap; Part Number: MC60ECA-04-BLE; Component Kind: Standard; Component Type: Standard; Device: MC60ECA-04-BLE; PackageDescription: Quectel MC60 GSM/GPRS/GNSS Module 18.7mm x 16.0mm; Manufacturer: Quectel; Manufacturer Part Number: MC60ECA-04-BLE; Pin Count: 68; Mounted: Yes; Socket: No; SMD: Yes; Sense: No; ComponentHeight: 2.1mm; Author: Xusniyor; HelpURL: https://eu.mouser.com/datasheet/2/1052/Quectel_MC60_GSM_Combo_Specification_V1_3-1830362.pdf; ComponentLink1URL: https://www.quectel.com/download/quectel_mc60_hardware_design_v2-1; ComponentLink1Description: Design Guide; CreateDate: 20.04.2023; LatestRevisionDate: 20.04.2023
R18 R19 = R0603_0R_JUMPER: Resistor; Part Description: 1A (0.05R Max DC Resistance) Zero Ohm Jumper; Manufacturer: GENERIC; Manufacturer1 Part Number: NRC06Z0; PressFit: No; Part Number: R0603_0R_JUMPER; Component Kind: Standard; Component Type: Standard; Pin Count: 2; Value: 0; Status: Preferred; Manufacturer Part Number: R0603_0R_JUMPER; Case: 0603; Mounted: Yes; Sense: No; Socket: No; SMD: Yes; Manufacturer1 Example: NIC COMPONENT; Manufacturer1 ComponentHeight: 0.55mm; HelpURL: \\cern.ch\dfs\Applications\Altium\Datasheets\R0603_NIC_NRC.pdf; Author: CERN DEM JLC; CreateDate: 03.12.2007; LatestRevisionDate: 13.03.2008
R20 = R0402_0R_JUMPER: Resistor; Part Description: 1A (0.05R Max DC Resistance) Zero Ohm Jumper; Manufacturer: GENERIC; Manufacturer1 Part Number: 232270591001L; PressFit: No; Part Number: R0402_0R_JUMPER; Component Kind: Standard; Component Type: Standard; Pin Count: 2; Value: 0; Status: Not Recommended; Manufacturer Part Number: R0402_0R_JUMPER; Case: 0402; Mounted: Yes; Sense: No; Socket: No; SMD: Yes; Manufacturer1 Example: YAGEO PHYCOMP; Manufacturer1 ComponentHeight: 0.4mm; HelpURL: \\cern.ch\dfs\Applications\Altium\Datasheets\R0402_Phycomp_RC0402.pdf; Author: CERN DEM JLC; CreateDate: 03.12.2007; LatestRevisionDate: 17.10.2012
T2 = PDTC114EU: Pre-Biased Bipolar Transistor (BJT) NPN - Pre-Biased 50 V 100 mA 200 mW Surface Mount SOT-323; Manufacturer: Nexperia USA Inc.; PressFit: No; Bonding: No; Part Number: PDTC114EU; Component Kind: Standard; Component Type: Standard; Device: PDTC114EU; PackageDescription: SOT323, 0.65mm pitch; 3 pin, 1.25mm W X 2.00mm L, IPC Medium Density; Part Description: Pre-Biased Bipolar Transistor (BJT) NPN - Pre-Biased 50 V 100 mA 200 mW Surface Mount SOT-323; Manufacturer Part Number: PDTC114EU; Pin Count: 3; Case: SOT-323; Mounted: Yes; Socket: No; SMD: Yes; Sense: No; ComponentHeight: 0.8mm; HelpURL: https://assets.nexperia.com/documents/data-sheet/PDTC114E_SER.pdf; Author: Xusniyor; CreateDate: 22.04.2023; LatestRevisionDate: 22.04.2023

## Sheet MCU.SchDoc
size A4; SheetNumber: 5; SheetTotal: 11
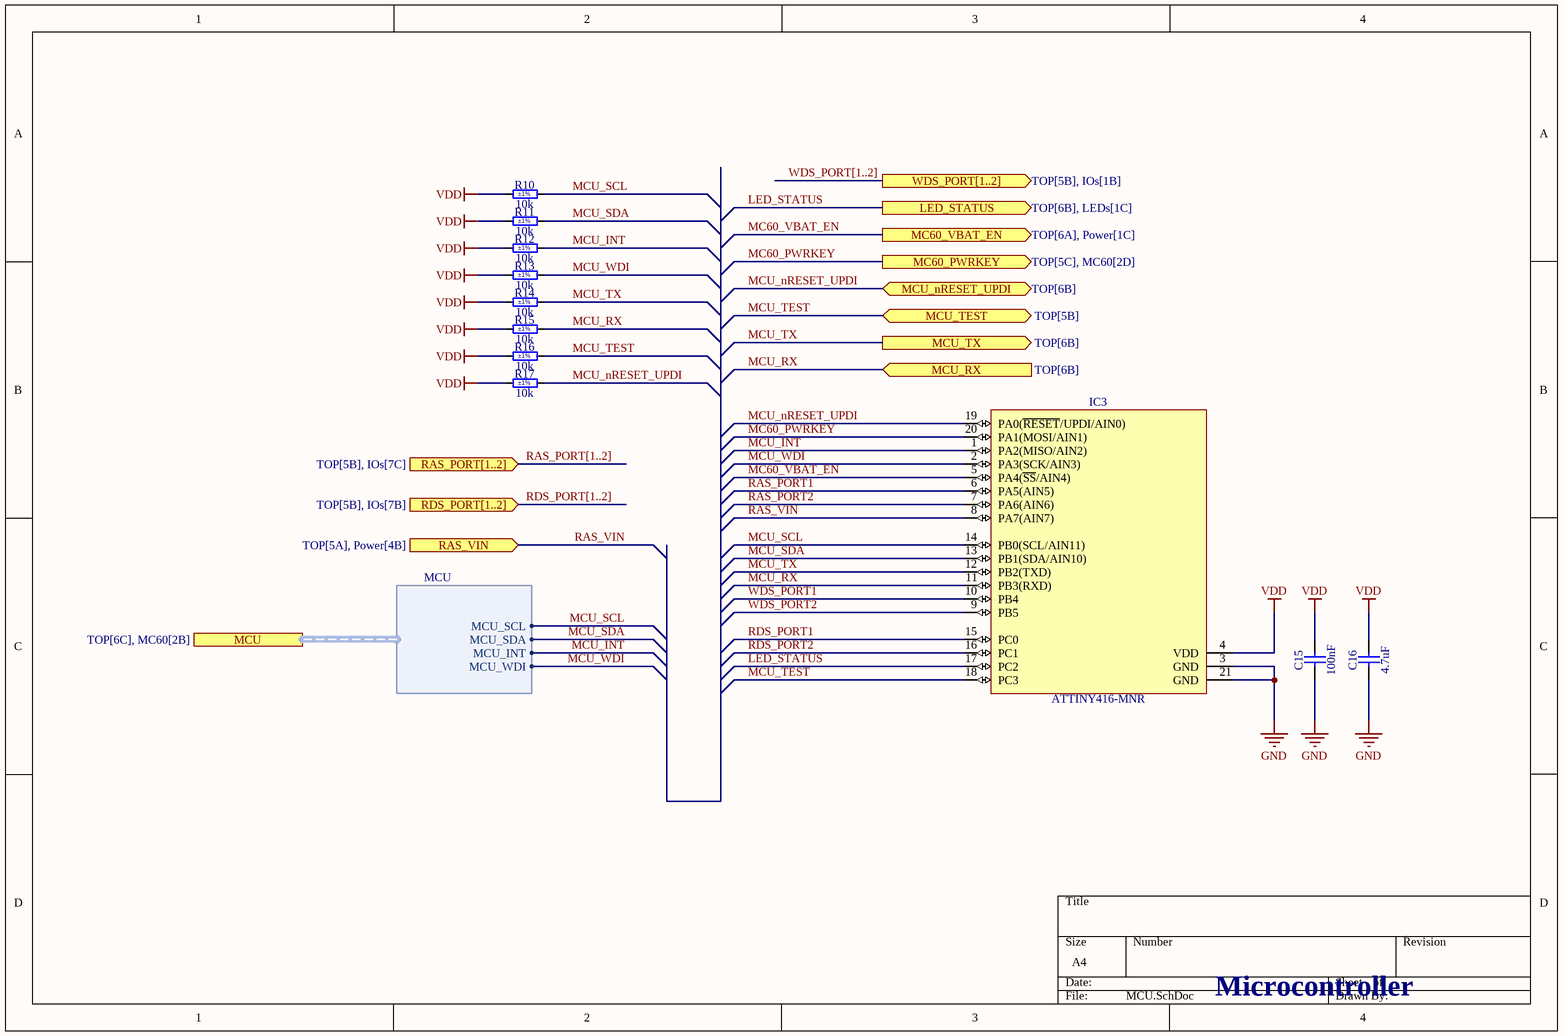
[diagram p4: MCU.SchDoc]

### Parts
C15  100nF  [CAPC1608X87N]
C16  4.7uF  [CAPC1709X95N]
IC3  ATTINY416-MNR  [QFN40P300X300X80-21N-S180]
R10  10k  Tolerance: ±1%  [RESC1608X55N]
R11  10k  Tolerance: ±1%  [RESC1608X55N]
R12  10k  Tolerance: ±1%  [RESC1608X55N]
R13  10k  Tolerance: ±1%  [RESC1608X55N]
R14  10k  Tolerance: ±1%  [RESC1608X55N]
R15  10k  Tolerance: ±1%  [RESC1608X55N]
R16  10k  Tolerance: ±1%  [RESC1608X55N]
R17  10k  Tolerance: ±1%  [RESC1608X55N]

### Ports
LED_STATUS (out, see TOP[6B], LEDs[1C]), MC60_PWRKEY (out, see TOP[5C], MC60[2D]), MC60_VBAT_EN (out, see TOP[6A], Power[1C]), MCU (harness MCU, see TOP[6C], MC60[2B]), MCU_nRESET_UPDI (bidir, see TOP[6B]), MCU_RX (in, see TOP[6B]), MCU_TEST (bidir, see TOP[5B]), MCU_TX (out, see TOP[6B]), RAS_PORT[1..2] (in, see TOP[5B], IOs[7C]), RAS_VIN (in, see TOP[5A], Power[4B]), RDS_PORT[1..2] (in, see TOP[5B], IOs[7B]), WDS_PORT[1..2] (out, see TOP[5B], IOs[1B])

### Harnesses
MCU: MCU_SCL, MCU_SDA, MCU_INT, MCU_WDI

### Nets
GND: C15.1 C16.1 IC3.3(GND) IC3.21(GND)
VDD: C15.2 C16.2 IC3.4(VDD) R10.1 R11.1 R12.1 R13.1 R14.1 R15.1 R16.1 R17.1
LED_STATUS: IC3.17(PC2) ; port LED_STATUS
MC60_PWRKEY: IC3.20(PA1(MOSI/AIN1)) ; port MC60_PWRKEY
MC60_VBAT_EN: IC3.5(PA4(~{SS}/AIN4)) ; port MC60_VBAT_EN
MCU_INT: IC3.1(PA2(MISO/AIN2)) R12.2 ; port MCU.MCU_INT
MCU_nRESET_UPDI: IC3.19(PA0(~{RESET}/UPDI/AIN0)) R17.2 ; port MCU_nRESET_UPDI
MCU_RX: IC3.11(PB3(RXD)) R15.2 ; port MCU_RX
MCU_SCL: IC3.14(PB0(SCL/AIN11)) R10.2 ; port MCU.MCU_SCL
MCU_SDA: IC3.13(PB1(SDA/AIN10)) R11.2 ; port MCU.MCU_SDA
MCU_TEST: IC3.18(PC3) R16.2 ; port MCU_TEST
MCU_TX: IC3.12(PB2(TXD)) R14.2 ; port MCU_TX
MCU_WDI: IC3.2(PA3(SCK/AIN3)) R13.2 ; port MCU.MCU_WDI
RAS_PORT1: IC3.6(PA5(AIN5))
RAS_PORT2: IC3.7(PA6(AIN6))
RAS_VIN: IC3.8(PA7(AIN7)) ; port RAS_VIN
RDS_PORT1: IC3.15(PC0)
RDS_PORT2: IC3.16(PC1)
WDS_PORT1: IC3.10(PB4)
WDS_PORT2: IC3.9(PB5)

### Buses and harness runs
bus RAS_PORT[1..2] = port RAS_PORT[1..2]
bus RDS_PORT[1..2] = port RDS_PORT[1..2]
bus WDS_PORT[1..2] = port WDS_PORT[1..2]

### Notes on the sheet
- Microcontroller

### Library data of the parts
C15 = CC0603_100NF_50V_10%_X7R: as C22 on sheet MC60; Part Number: CC0603_100NF_50V_10%_X7R; Component Kind: Standard; Component Type: Standard; Pin Count: 2; Value: 100nF; Status: Preferred; Manufacturer Part Number: CC0603_100NF_50V_10%_X7R; Case: 0603; Mounted: Yes; Socket: No; SMD: Yes; Sense: No; Manufacturer1 Example: PHYCOMP; Manufacturer1 ComponentHeight: 0.87mm; HelpURL: \\cern.ch\dfs\Applications\Altium\Datasheets\CC0603_X7R_PHYCOMP.pdf; Author: CERN DEM JLC; CreateDate: 03.12.2007; LatestRevisionDate: 03.12.2007
C16 = CC0603_4.7UF_16V_10%_X5R: Non-polarised capacitor; Part Description: SMD Multilayer Chip Ceramic Capacitor; Manufacturer: GENERIC; Manufacturer1 Part Number: EMK107ABJ475KA-T; Voltage: 16V; TC: X5R; Tolerance: ±10%; Part Number: CC0603_4.7UF_16V_10%_X5R; Component Kind: Standard; Component Type: Standard; Pin Count: 2; Value: 4.7uF; Status: None; Manufacturer Part Number: CC0603_4.7UF_16V_10%_X5R; Case: 0603; Mounted: Yes; Socket: No; SMD: Yes; Sense: No; Manufacturer1 Example: TAIYO YUDEN; Manufacturer1 ComponentHeight: 0.95mm; HelpURL: \\cern.ch\dfs\Applications\Altium\Datasheets\CC0603_X7R_TAIYO-YUDEN_HIGH-VALUE.pdf; Author: CERN DEM JLC; CreateDate: 16.12.2013; LatestRevisionDate: 16.09.2014
IC3 = ATTINY416-MNR: AVR tinyAVR™ 1, Functional Safety (FuSa) Microcontroller IC 8-Bit 20MHz 4KB (4K x 8) FLASH 20-VQFN (3x3); Manufacturer: MICROCHIP TECHNOLOGY; PressFit: No; Bonding: No; Part Number: ATTINY416-MNR; Component Kind: Standard; Component Type: Standard; Device: ATTINY416-MNR; PackageDescription: QFN, 0.40mm Pitch, Square, 20 Pin, 3.00mm L X 3.00mm W X 0.80mm H body (w/thermal tab); Part Description: AVR tinyAVR™ 1, Functional Safety (FuSa) Microcontroller IC 8-Bit 20MHz 4KB (4K x 8) FLASH 20-VQFN (3x3); Manufacturer Part Number: ATTINY416-MNR; Pin Count: 21; Case: QFN20; Mounted: Yes; Socket: No; SMD: Yes; Sense: No; ComponentHeight: 0.85mm; HelpURL: https://ww1.microchip.com/downloads/en/DeviceDoc/ATtiny212-214-412-414-416-DataSheet-DS40002287A.pdf; Author: Xusniyor; CreateDate: 22.04.2023; LatestRevisionDate: 22.04.2023
R10-R17 = R0603_10K_1%_0.1W_100PPM: Resistor - 1%; Part Description: General Purpose Thick Film Chip Resistor; Manufacturer: GENERIC; Manufacturer1 Part Number: NRC06F1002TRF; Power: 0.1W; TC: ±100ppm/°C; PressFit: No; Part Number: R0603_10K_1%_0.1W_100PPM; Component Kind: Standard; Component Type: Standard; Pin Count: 2; Value: 10k; Status: Preferred; Manufacturer Part Number: R0603_10K_1%_0.1W_100PPM; Case: 0603; Mounted: Yes; Sense: No; Socket: No; SMD: Yes; Manufacturer1 Example: NIC COMPONENT; Manufacturer1 ComponentHeight: 0.55mm; HelpURL: \\cern.ch\dfs\Applications\Altium\Datasheets\R0603_NIC_NRC.pdf; Author: CERN DEM JLC; CreateDate: 03.12.2007; LatestRevisionDate: 13.03.2008

## Sheet EEPROM.SchDoc
size A4; SheetNumber: 7; SheetTotal: 11
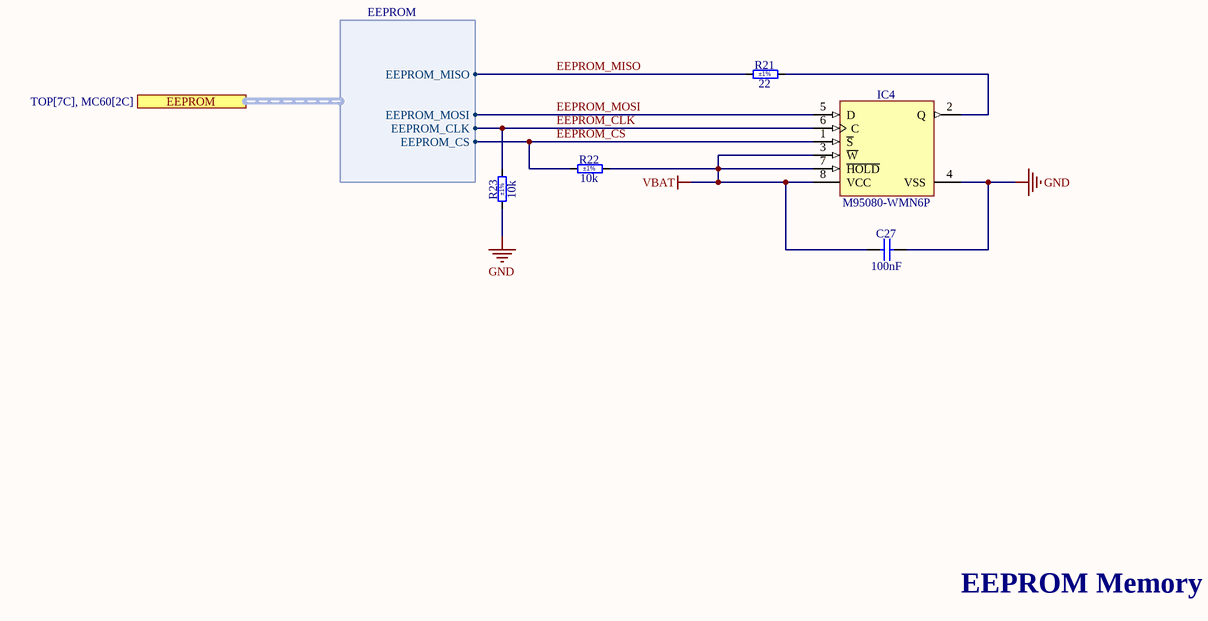
[diagram p5: EEPROM.SchDoc]

### Parts
C27  100nF  [CAPC1608X87N]
IC4  M95080-WMN6P  [SOIC127P600X175-8N]
R21  22  Tolerance: ±1%  [RESC1608X55N]
R22  10k  Tolerance: ±1%  [RESC1608X55N]
R23  10k  Tolerance: ±1%  [RESC1608X55N]

### Ports
EEPROM (harness EEPROM, see TOP[7C], MC60[2C])

### Harnesses
EEPROM: EEPROM_MISO, EEPROM_MOSI, EEPROM_CLK, EEPROM_CS

### Nets
GND: C27.2 IC4.4(VSS) R23.1
VBAT: C27.1 IC4.3(~{W}) IC4.7(~{HOLD}) IC4.8(VCC) R22.2
EEPROM_CLK: IC4.6(C) R23.2 ; port EEPROM.EEPROM_CLK
EEPROM_CS: IC4.1(~{S}) R22.1 ; port EEPROM.EEPROM_CS
EEPROM_MISO: R21.1 ; port EEPROM.EEPROM_MISO
EEPROM_MOSI: IC4.5(D) ; port EEPROM.EEPROM_MOSI
NetIC4_2: IC4.2(Q) R21.2

### Notes on the sheet
- EEPROM Memory

### Library data of the parts
C27 = CC0603_100NF_50V_10%_X7R: as C22 on sheet MC60; Part Number: CC0603_100NF_50V_10%_X7R; Component Kind: Standard; Component Type: Standard; Pin Count: 2; Value: 100nF; Status: Preferred; Manufacturer Part Number: CC0603_100NF_50V_10%_X7R; Case: 0603; Mounted: Yes; Socket: No; SMD: Yes; Sense: No; Manufacturer1 Example: PHYCOMP; Manufacturer1 ComponentHeight: 0.87mm; HelpURL: \\cern.ch\dfs\Applications\Altium\Datasheets\CC0603_X7R_PHYCOMP.pdf; Author: CERN DEM JLC; CreateDate: 03.12.2007; LatestRevisionDate: 03.12.2007
IC4 = M95080-WMN6P: 2.5 to 5.5 V, 8Kb (1024x8) Serial SPI Bus EEPROM with High-Speed Clock; Manufacturer: ST MICROELECTRONICS; PressFit: No; Bonding: No; Part Number: M95080-WMN6P; Component Kind: Standard; Component Type: Standard; Device: M95080-WMN6P; PackageDescription: SOIC, 1.27mm Pitch; 8 Pin - Body 4x5mm, IPC Medium Density; Part Description: 2.5 to 5.5V, 8Kb (1024x8) Serial SPI Bus EEPROM with High-Speed Clock; Manufacturer Part Number: M95080-WMN6P; Pin Count: 8; Case: SOIC8; Mounted: Yes; Socket: No; SMD: Yes; Sense: No; ComponentHeight: 1.75mm; HelpURL: \\cern.ch\dfs\Applications\Altium\Datasheets\M95080-WMN6P.pdf; Author: CERN DEM JLC; CreateDate: 20.06.2017; LatestRevisionDate: 20.06.2017
R21 = R0603_22R_1%_0.1W_100PPM: Resistor - 1%; Part Description: General Purpose Thick Film Chip Resistor; Manufacturer: GENERIC; Manufacturer1 Part Number: NRC06F22R0TRF; Power: 0.1W; TC: ±100ppm/°C; PressFit: No; Part Number: R0603_22R_1%_0.1W_100PPM; Component Kind: Standard; Component Type: Standard; Pin Count: 2; Value: 22; Status: Preferred; Manufacturer Part Number: R0603_22R_1%_0.1W_100PPM; Case: 0603; Mounted: Yes; Sense: No; Socket: No; SMD: Yes; Manufacturer1 Example: NIC COMPONENT; Manufacturer1 ComponentHeight: 0.55mm; HelpURL: \\cern.ch\dfs\Applications\Altium\Datasheets\R0603_NIC_NRC.pdf; Author: CERN DEM JLC; CreateDate: 03.12.2007; LatestRevisionDate: 13.03.2008
R22 R23 = R0603_10K_1%_0.1W_100PPM: as R10 on sheet MCU; Part Number: R0603_10K_1%_0.1W_100PPM; Component Kind: Standard; Component Type: Standard; Pin Count: 2; Value: 10k; Status: Preferred; Manufacturer Part Number: R0603_10K_1%_0.1W_100PPM; Case: 0603; Mounted: Yes; Sense: No; Socket: No; SMD: Yes; Manufacturer1 Example: NIC COMPONENT; Manufacturer1 ComponentHeight: 0.55mm; HelpURL: \\cern.ch\dfs\Applications\Altium\Datasheets\R0603_NIC_NRC.pdf; Author: CERN DEM JLC; CreateDate: 03.12.2007; LatestRevisionDate: 13.03.2008

## Sheet SIM.SchDoc
size A4; SheetNumber: 9; SheetTotal: 11
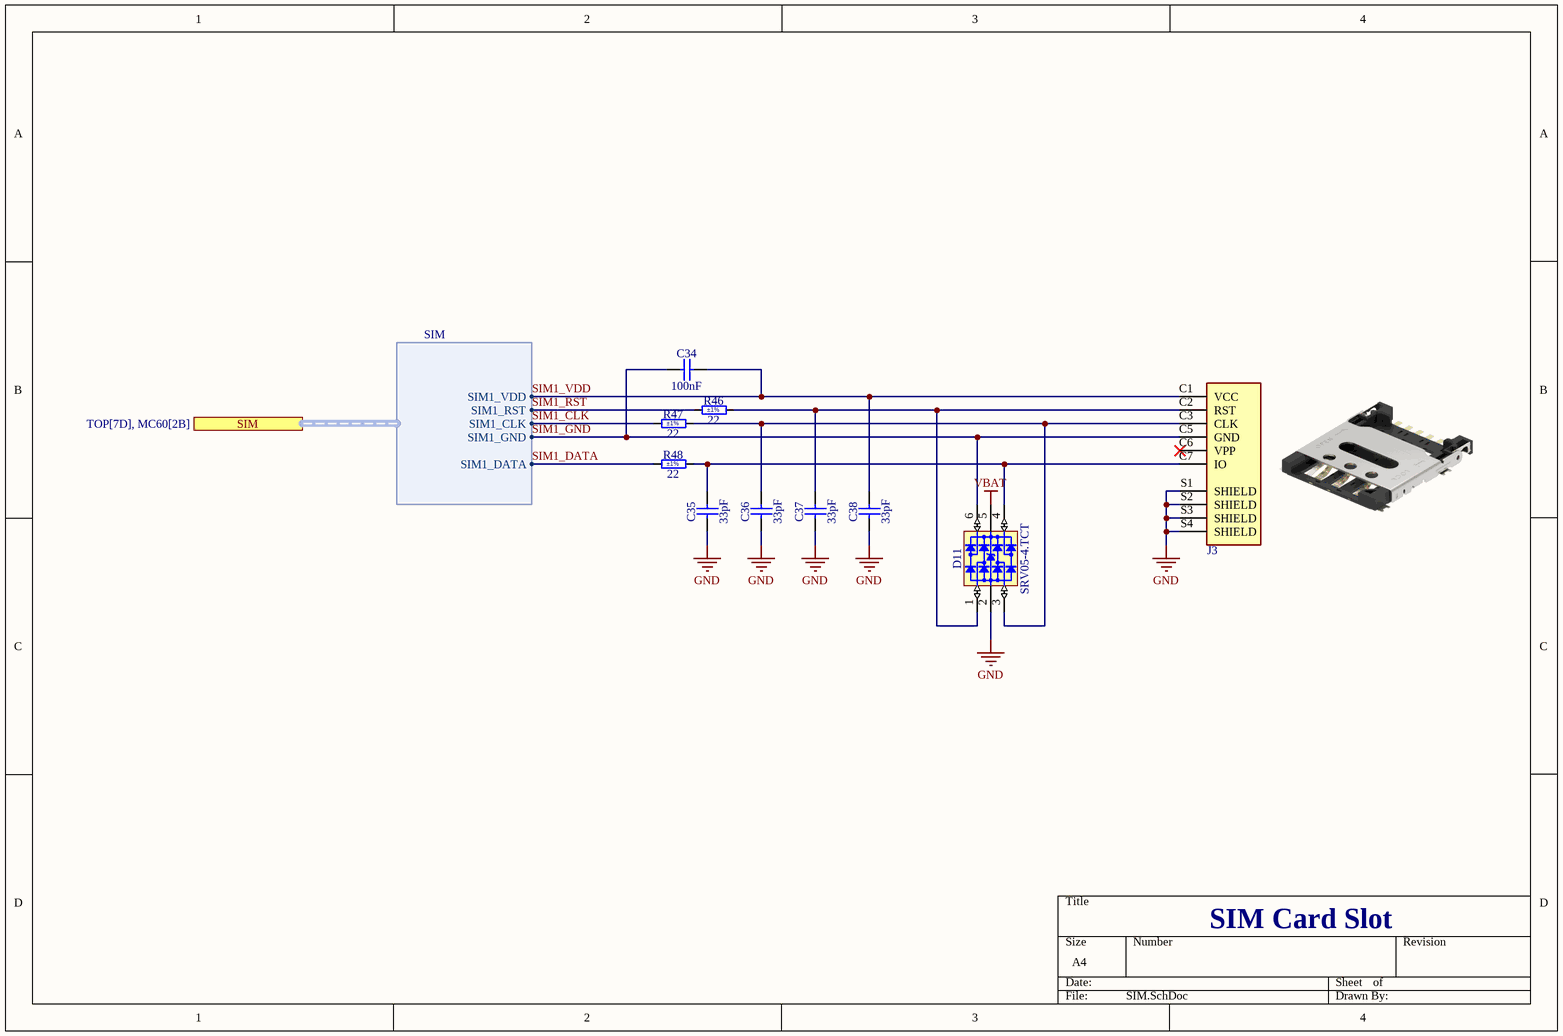
[diagram p6: SIM.SchDoc]

### Parts
C34  100nF  [CAPC1608X87N]
C35  33pF  [CAPC1608X87N]
C36  33pF  [CAPC1608X87N]
C37  33pF  [CAPC1608X87N]
C38  33pF  [CAPC1608X87N]
D11  SRV05-4.TCT  [SOT95P280X145-6N]
J3  SIM8060-6-0-14-00-A  [GCT_SIM8060-6-0-14-00-A]  (value not drawn)
R46  22  Tolerance: ±1%  [RESC1608X55N]
R47  22  Tolerance: ±1%  [RESC1608X55N]
R48  22  Tolerance: ±1%  [RESC1608X55N]

### Ports
SIM (harness SIM, see TOP[7D], MC60[2B])

### Harnesses
SIM: SIM1_VDD, SIM1_RST, SIM1_CLK, SIM1_GND, SIM1_DATA

### Nets
GND: C35.1 C36.1 C37.1 C38.1 D11.2(GND) J3.S1(SHIELD) J3.S2(SHIELD) J3.S3(SHIELD) J3.S4(SHIELD)
VBAT: D11.5(VBUS)
SIM1_CLK: R47.1 ; port SIM.SIM1_CLK
SIM1_DATA: R48.1 ; port SIM.SIM1_DATA
SIM1_GND: C34.1 D11.6(I/O4) J3.C5(GND) ; port SIM.SIM1_GND
SIM1_RST: R46.1 ; port SIM.SIM1_RST
SIM1_VDD: C34.2 C38.2 J3.C1(VCC) ; port SIM.SIM1_VDD
NetC35_2: C35.2 D11.4(I/O3) J3.C7(IO) R48.2
NetC36_2: C36.2 D11.3(I/O2) J3.C3(CLK) R47.2
NetC37_2: C37.2 D11.1(I/O1) J3.C2(RST) R46.2

Not connected (* = marked no-connect by the designer): J3 C6(VPP)*

### Notes on the sheet
- SIM Card Slot

### Library data of the parts
C34 = CC0603_100NF_50V_10%_X7R: as C22 on sheet MC60; Part Number: CC0603_100NF_50V_10%_X7R; Component Kind: Standard; Component Type: Standard; Pin Count: 2; Value: 100nF; Status: Preferred; Manufacturer Part Number: CC0603_100NF_50V_10%_X7R; Case: 0603; Mounted: Yes; Socket: No; SMD: Yes; Sense: No; Manufacturer1 Example: PHYCOMP; Manufacturer1 ComponentHeight: 0.87mm; HelpURL: \\cern.ch\dfs\Applications\Altium\Datasheets\CC0603_X7R_PHYCOMP.pdf; Author: CERN DEM JLC; CreateDate: 03.12.2007; LatestRevisionDate: 03.12.2007
C35-C38 = CC0603_33PF_50V_5%_NP0: as C24 on sheet MC60; Part Number: CC0603_33PF_50V_5%_NP0; Component Kind: Standard; Component Type: Standard; Pin Count: 2; Value: 33pF; Status: Preferred; Manufacturer Part Number: CC0603_33PF_50V_5%_NP0; Case: 0603; Mounted: Yes; Socket: No; SMD: Yes; Sense: No; Manufacturer1 Example: PHYCOMP; Manufacturer1 ComponentHeight: 0.87mm; HelpURL: \\cern.ch\dfs\Applications\Altium\Datasheets\CC0603_NP0_PHYCOMP.pdf; Author: CERN DEM JLC; CreateDate: 03.12.2007; LatestRevisionDate: 03.12.2007
D11 = SRV05-4.TCT: RailClamps Low Capacitance TVS Diode Array; Part Description: RailClamps Low Capacitance TVS Diode Array, ESD (15kV) Protection; Manufacturer: SEMTECH; Power: 300W; PressFit: No; Bonding: No; Part Number: SRV05-4.TCT; Component Kind: Standard; Component Type: Standard; Device: SRV05-4.TCT; PackageDescription: SOT, 0.95mm Pitch; 6 Pin, 1.60mm W X 3.00mm L X 1.45mm H body, IPC Medium Density; Status: Not recommended; Manufacturer Part Number: SRV05-4.TCT; Pin Count: 6; Case: SOT23-6; Mounted: Yes; Socket: No; SMD: Yes; Sense: No; ComponentHeight: 1.45mm; HelpURL: \\cern.ch\dfs\Applications\Altium\Datasheets\SRV05-4.TCT.pdf; Author: CERN DEM JLC; CreateDate: 22.07.2013; LatestRevisionDate: 22.07.2013
J3 = GCT_SIM8060-6-0-14-00-A: 6 Position Card Connector NANO SIM Surface Mount, Right Angle Gold; Manufacturer: GCT; MF: Global Connector Technology; Mounted: No; MP: SIM8060-6-0-14-00-A; Package: Package Analog Devices; Price: None; Availability: Unavailable; SnapEDA_Link: https://www.snapeda.com/parts/SIM8060-6-0-14-00-A/Global%20Connector%20Technology/view-part/3214904/?ref=snap; Value: *; Part Number: GCT_SIM8060-6-0-14-00-A; Pin Count: 6; Family: SIM8060; Socket: No; SMD: Yes; Sense: No; Status: None; Device: SIM8060-6-0-14-00-A; Part Description: 6 Position Card Connector NANO SIM Surface Mount, Right Angle Gold; Manufacturer Part Number: SIM8060-6-0-14-00-A; ComponentHeight: 1.4mm; HelpURL: https://media.digikey.com/pdf/Data%20Sheets/GCT%20PDFs/SIM8060_Spec.pdf; Author: Xusniyor; CreateDate: 30.04.2023; LatestRevisionDate: 30.04.2023
R46-R48 = R0603_22R_1%_0.1W_100PPM: as R21 on sheet EEPROM; Part Number: R0603_22R_1%_0.1W_100PPM; Component Kind: Standard; Component Type: Standard; Pin Count: 2; Value: 22; Status: Preferred; Manufacturer Part Number: R0603_22R_1%_0.1W_100PPM; Case: 0603; Mounted: Yes; Sense: No; Socket: No; SMD: Yes; Manufacturer1 Example: NIC COMPONENT; Manufacturer1 ComponentHeight: 0.55mm; HelpURL: \\cern.ch\dfs\Applications\Altium\Datasheets\R0603_NIC_NRC.pdf; Author: CERN DEM JLC; CreateDate: 03.12.2007; LatestRevisionDate: 13.03.2008